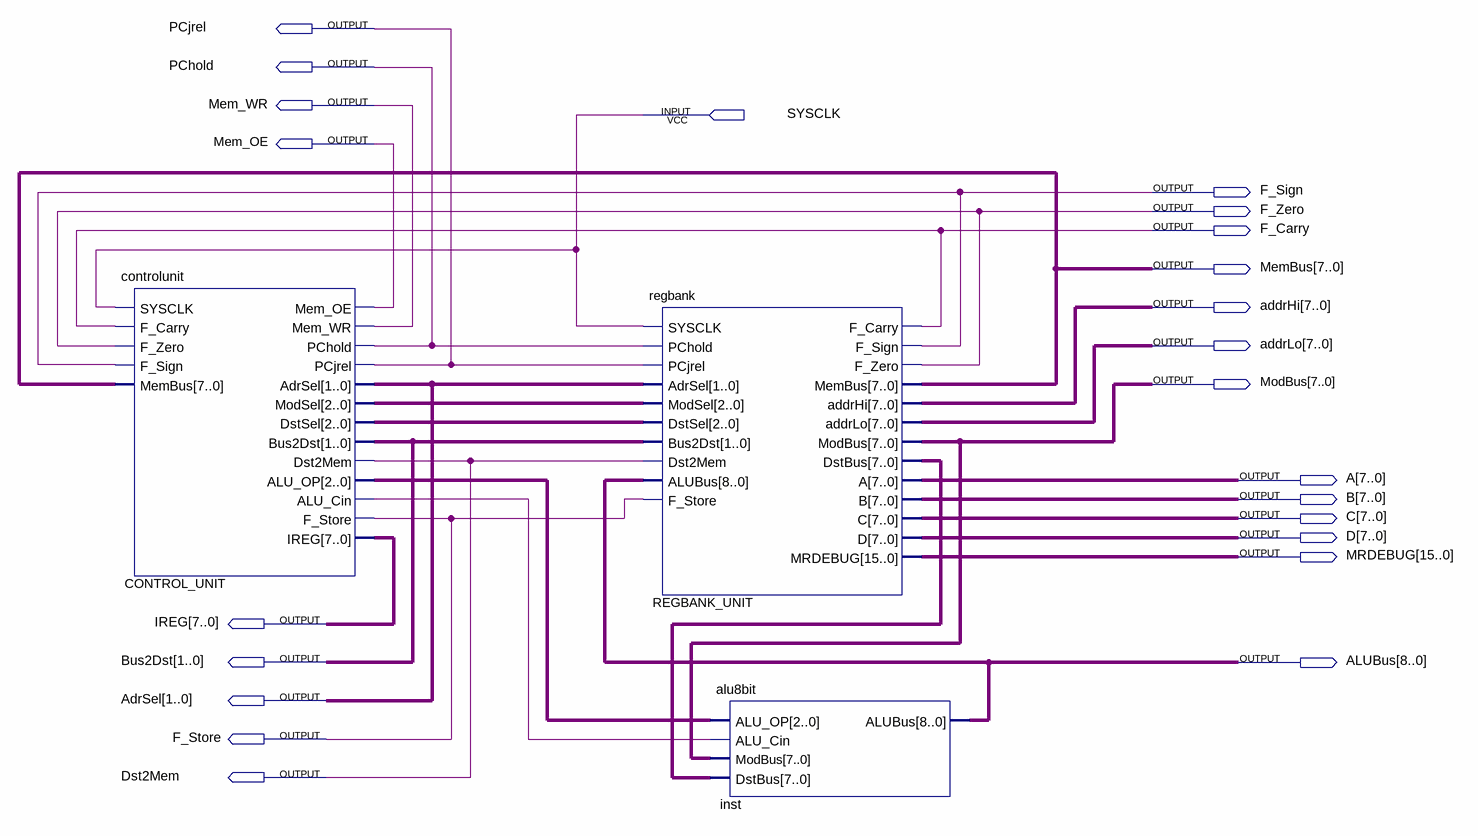
[diagram p0: schematic sheet]
// Quartus schematic rev3core.bdf as structural Verilog: 3 symbols, 23 pins
module rev3core (
  input  SYSCLK,
  output PCjrel,
  output PChold,
  output Mem_WR,
  output Mem_OE,
  output F_Sign,
  output F_Zero,
  output F_Carry,
  output [7:0] MemBus,
  output [7:0] addrHi,
  output [7:0] addrLo,
  output [7:0] ModBus,
  output [7:0] A,
  output [7:0] B,
  output [7:0] C,
  output [7:0] D,
  output [15:0] MRDEBUG,
  output [7:0] IREG,
  output [1:0] Bus2Dst,
  output [8:0] ALUBus,
  output [1:0] AdrSel,
  output F_Store,
  output Dst2Mem
);

  wire CONTROL_UNIT_alu_cin;
  wire [2:0] CONTROL_UNIT_alu_op, CONTROL_UNIT_dstsel, CONTROL_UNIT_modsel;
  wire [7:0] REGBANK_UNIT_dstbus;

  controlunit CONTROL_UNIT (
    .SYSCLK(SYSCLK), .F_Carry(F_Carry), .F_Zero(F_Zero), .F_Sign(F_Sign), .MemBus(MemBus), .Mem_OE(Mem_OE),
    .Mem_WR(Mem_WR), .PChold(PChold), .PCjrel(PCjrel), .AdrSel(AdrSel), .ModSel(CONTROL_UNIT_modsel),
    .DstSel(CONTROL_UNIT_dstsel), .Bus2Dst(Bus2Dst), .Dst2Mem(Dst2Mem), .ALU_OP(CONTROL_UNIT_alu_op),
    .ALU_Cin(CONTROL_UNIT_alu_cin), .F_Store(F_Store), .IREG(IREG));
  regbank REGBANK_UNIT (
    .SYSCLK(SYSCLK), .PChold(PChold), .PCjrel(PCjrel), .AdrSel(AdrSel), .ModSel(CONTROL_UNIT_modsel),
    .DstSel(CONTROL_UNIT_dstsel), .Bus2Dst(Bus2Dst), .Dst2Mem(Dst2Mem), .ALUBus(ALUBus), .F_Store(F_Store),
    .F_Carry(F_Carry), .F_Sign(F_Sign), .F_Zero(F_Zero), .addrHi(addrHi), .addrLo(addrLo),
    .DstBus(REGBANK_UNIT_dstbus), .A(A), .B(B), .C(C), .D(D), .MRDEBUG(MRDEBUG), .MemBus(MemBus),
    .ModBus(ModBus));
  alu8bit inst (
    .ALU_OP(CONTROL_UNIT_alu_op), .ALU_Cin(CONTROL_UNIT_alu_cin), .ModBus(ModBus),
    .DstBus(REGBANK_UNIT_dstbus), .ALUBus(ALUBus));
endmodule
